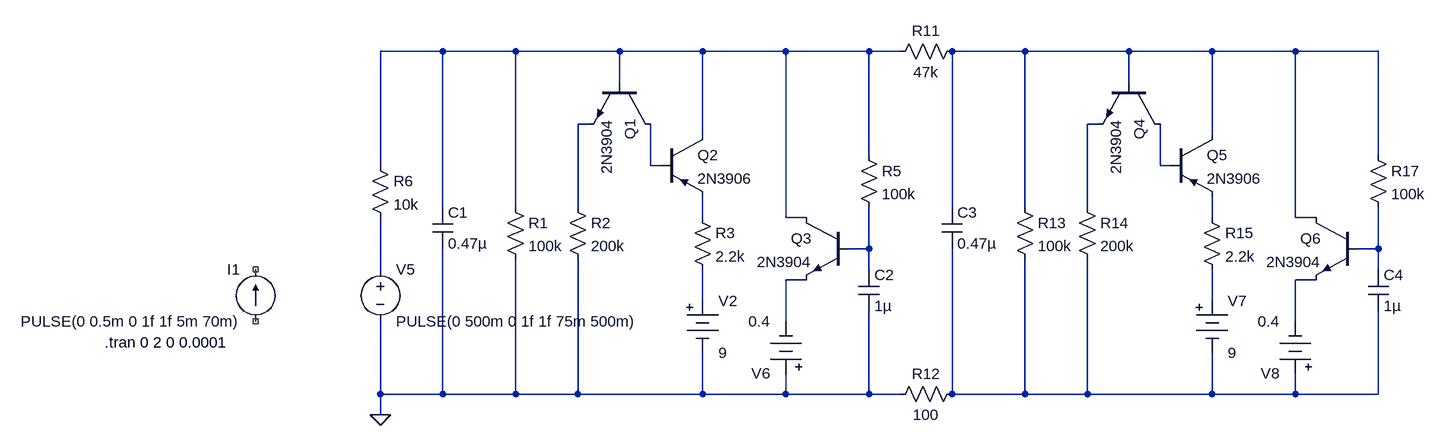
[diagram p0: schematic Weak_Stimulus.asc]
Weak_Stimulus.asc, the LTspice schematic file:
Version 4
SHEET 1 3572 1052
WIRE -496 -80 -592 -80
WIRE -384 -80 -496 -80
WIRE -224 -80 -384 -80
WIRE -96 -80 -224 -80
WIRE 32 -80 -96 -80
WIRE 160 -80 32 -80
WIRE 208 -80 160 -80
WIRE 400 -80 288 -80
WIRE 560 -80 400 -80
WIRE 688 -80 560 -80
WIRE 816 -80 688 -80
WIRE 944 -80 816 -80
WIRE -224 -32 -224 -80
WIRE 560 -32 560 -80
WIRE -272 32 -288 32
WIRE 512 32 496 32
WIRE -96 48 -96 -80
WIRE 688 48 688 -80
WIRE 160 80 160 -80
WIRE 944 80 944 -80
WIRE -592 96 -592 -80
WIRE -176 96 -176 32
WIRE -160 96 -176 96
WIRE 608 96 608 32
WIRE 624 96 608 96
WIRE -496 160 -496 -80
WIRE -384 160 -384 -80
WIRE -288 160 -288 32
WIRE 288 160 288 -80
WIRE 400 160 400 -80
WIRE 496 160 496 32
WIRE -96 176 -96 144
WIRE 32 176 32 -80
WIRE 64 176 32 176
WIRE 688 176 688 144
WIRE 816 176 816 -80
WIRE 848 176 816 176
WIRE 160 224 160 160
WIRE 160 224 128 224
WIRE 944 224 944 160
WIRE 944 224 912 224
WIRE -592 256 -592 176
WIRE 160 256 160 224
WIRE 944 256 944 224
WIRE 64 272 32 272
WIRE 848 272 816 272
WIRE -96 304 -96 256
WIRE 688 304 688 256
WIRE 32 336 32 272
WIRE 816 336 816 272
WIRE -592 448 -592 336
WIRE -496 448 -496 224
WIRE -496 448 -592 448
WIRE -384 448 -384 240
WIRE -384 448 -496 448
WIRE -288 448 -288 240
WIRE -288 448 -384 448
WIRE -96 448 -96 384
WIRE -96 448 -288 448
WIRE 32 448 32 416
WIRE 32 448 -96 448
WIRE 160 448 160 320
WIRE 160 448 32 448
WIRE 208 448 160 448
WIRE 288 448 288 224
WIRE 400 448 400 240
WIRE 400 448 288 448
WIRE 496 448 496 240
WIRE 496 448 400 448
WIRE 688 448 688 384
WIRE 688 448 496 448
WIRE 816 448 816 416
WIRE 816 448 688 448
WIRE 944 448 944 320
WIRE 944 448 816 448
WIRE -592 480 -592 448
FLAG -592 480 0
SYMBOL res -400 144 R0
SYMATTR InstName R1
SYMATTR Value 100k
SYMBOL res -304 144 R0
SYMATTR InstName R2
SYMATTR Value 200k
SYMBOL res -112 160 R0
SYMATTR InstName R3
SYMATTR Value 2.2k
SYMBOL res 144 64 R0
SYMATTR InstName R5
SYMATTR Value 100k
SYMBOL cap -512 160 R0
SYMATTR InstName C1
SYMATTR Value 0.47µ
SYMBOL cap 144 256 R0
SYMATTR InstName C2
SYMATTR Value 1µ
SYMBOL current -784 336 R180
WINDOW 0 24 80 Left 2
WINDOW 3 24 0 Left 2
WINDOW 123 0 0 Left 0
WINDOW 39 0 0 Left 0
SYMATTR InstName I1
SYMATTR Value PULSE(0 0.5m 0 1f 1f 5m 70m)
SYMBOL npn -176 -32 R90
SYMATTR InstName Q1
SYMATTR Value 2N3904
SYMBOL pnp -160 48 R0
SYMATTR InstName Q2
SYMATTR Value 2N3906
SYMBOL Misc\\battery -96 288 R0
WINDOW 123 0 0 Left 0
WINDOW 39 0 0 Left 0
SYMATTR InstName V2
SYMATTR Value 9
SYMBOL npn 128 176 M0
SYMATTR InstName Q3
SYMATTR Value 2N3904
SYMBOL res 304 -96 R90
WINDOW 0 0 56 VBottom 2
WINDOW 3 32 56 VTop 2
SYMATTR InstName R11
SYMATTR Value 47k
SYMBOL res 304 432 R90
WINDOW 0 0 56 VBottom 2
WINDOW 3 32 56 VTop 2
SYMATTR InstName R12
SYMATTR Value 100
SYMBOL res 384 144 R0
SYMATTR InstName R13
SYMATTR Value 100k
SYMBOL res 480 144 R0
SYMATTR InstName R14
SYMATTR Value 200k
SYMBOL res 672 160 R0
SYMATTR InstName R15
SYMATTR Value 2.2k
SYMBOL res 928 64 R0
SYMATTR InstName R17
SYMATTR Value 100k
SYMBOL cap 272 160 R0
SYMATTR InstName C3
SYMATTR Value 0.47µ
SYMBOL cap 928 256 R0
SYMATTR InstName C4
SYMATTR Value 1µ
SYMBOL npn 608 -32 R90
SYMATTR InstName Q4
SYMATTR Value 2N3904
SYMBOL pnp 624 48 R0
SYMATTR InstName Q5
SYMATTR Value 2N3906
SYMBOL Misc\\battery 688 288 R0
WINDOW 123 0 0 Left 0
WINDOW 39 0 0 Left 0
SYMATTR InstName V7
SYMATTR Value 9
SYMBOL npn 912 176 M0
SYMATTR InstName Q6
SYMATTR Value 2N3904
SYMBOL voltage -592 240 R0
WINDOW 123 0 0 Left 0
WINDOW 39 0 0 Left 0
SYMATTR InstName V5
SYMATTR Value PULSE(0 500m 0 1f 1f 75m 500m)
SYMBOL res -608 80 R0
SYMATTR InstName R6
SYMATTR Value 10k
SYMBOL Misc\\battery 32 432 R180
WINDOW 123 0 0 Left 0
WINDOW 39 0 0 Left 0
SYMATTR InstName V6
SYMATTR Value 0.4
SYMBOL Misc\\battery 816 432 R180
WINDOW 123 0 0 Left 0
WINDOW 39 0 0 Left 0
SYMATTR InstName V8
SYMATTR Value 0.4
TEXT -1016 368 Left 2 !.tran 0 2 0 0.0001

The netlist it stands for:
* Weak_Stimulus.asc
R1 N001 0 100k
R2 N003 0 200k
R3 N007 N014 2.2k
R5 N001 N009 100k
C1 N001 0 0.47µ
C2 N009 0 1µ
I1 NC_01 NC_02 PULSE(0 0.5m 0 1f 1f 5m 70m)
Q1 N005 N001 N003 0 2N3904
Q2 N001 N005 N007 0 2N3906
V2 N014 0 9
Q3 N001 N009 N012 0 2N3904
R11 N002 N001 47k
R12 N016 0 100
R13 N002 N016 100k
R14 N004 N016 200k
R15 N008 N015 2.2k
R17 N002 N010 100k
C3 N002 N016 0.47µ
C4 N010 N016 1µ
Q4 N006 N002 N004 0 2N3904
Q5 N002 N006 N008 0 2N3906
V7 N015 N016 9
Q6 N002 N010 N013 0 2N3904
V5 N011 0 PULSE(0 500m 0 1f 1f 75m 500m)
R6 N001 N011 10k
V6 0 N012 0.4
V8 N016 N013 0.4
.model NPN NPN
.model PNP PNP
.lib standard.bjt
.tran 0 2 0 0.0001
.backanno
.end